# EAGLE design untitled (EAGLE 9.5.1)
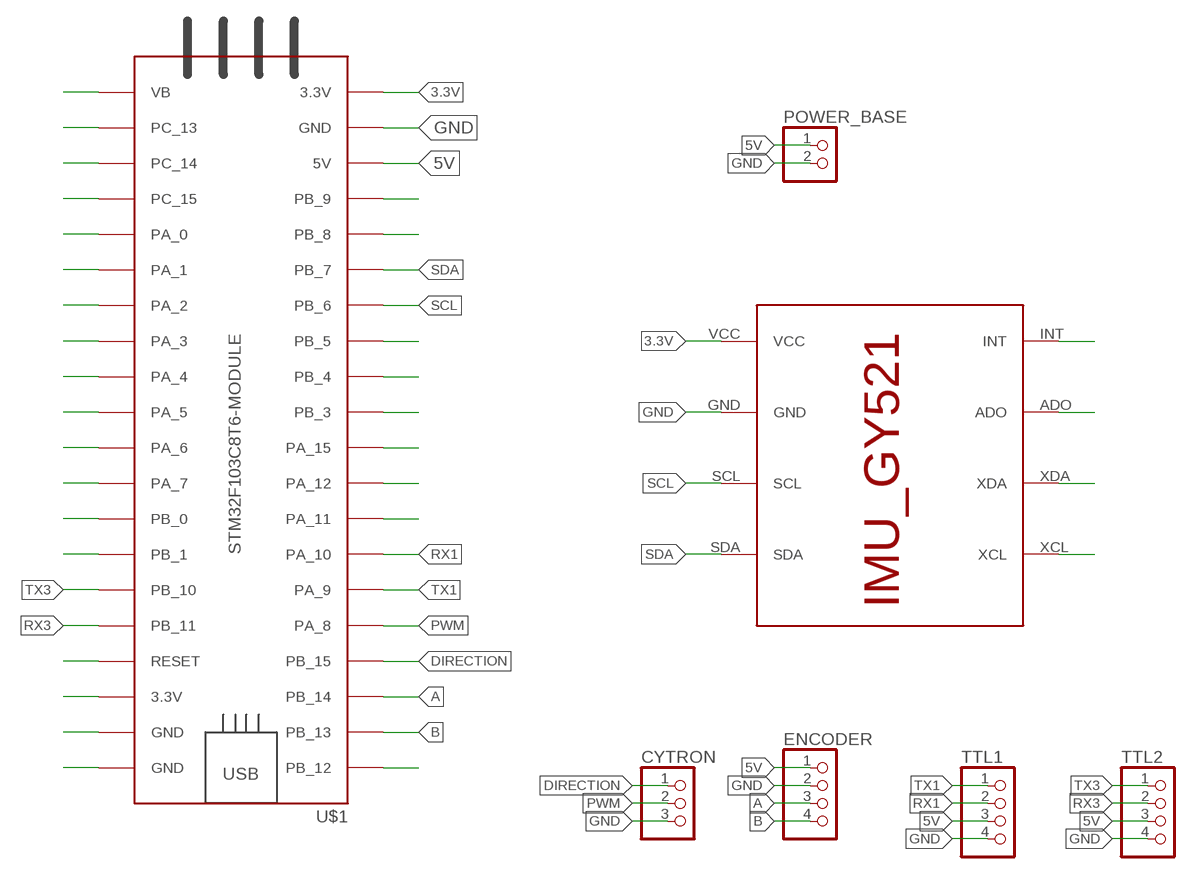
[diagram p0: schematic, sheet 1]

## Parts
CYTRON  PINHD-1X3  [1X03]
ENCODER  PINHD-1X4  [1X04]
POWER_BASE  PINHD-2_DATA  [1X02_DATA]
TTL1  PINHD-1X4  [1X04]
TTL2  PINHD-1X4  [1X04]
U$1  STM32F103C8T6-MODULE  [STM32F103C8T6-MODULE]
U$2  IMU_ROBOCON_GY521  [IMU_GY521]

## Nets
3.3V: U$1.3.3V_1(3.3V) U$1.3.3V_2(3.3V) U$2.VCC
5V: ENCODER.1 POWER_BASE.1 TTL1.3 TTL2.3 U$1.5V
A: ENCODER.3 U$1.PB_14
B: ENCODER.4 U$1.PB_13
DIRECTION: CYTRON.1 U$1.PB_15
GND: CYTRON.3 ENCODER.2 POWER_BASE.2 TTL1.4 TTL2.4 U$1.GND_1(GND) U$1.GND_2(GND) U$1.GND_3(GND) U$2.GND
N$1: U$1.PB_12
N$8: U$1.PA_11
N$9: U$1.PA_12
N$10: U$1.PA_15
N$11: U$1.PB_3
N$12: U$1.PB_4
N$13: U$1.PB_5
N$16: U$1.PB_8
N$17: U$1.PB_9
N$21: U$1.VB
N$22: U$1.PC_13
N$23: U$1.PC_14
N$24: U$1.PC_15
N$25: U$1.PA_0
N$26: U$1.PA_1
N$27: U$1.PA_2
N$28: U$1.PA_3
N$29: U$1.PA_4
N$30: U$1.PA_5
N$31: U$1.PA_6
N$32: U$1.PA_7
N$37: U$1.RESET
N$41: U$2.XCL
N$42: U$2.XDA
N$43: U$2.ADO
N$44: U$2.INT
PWM: CYTRON.2 U$1.PA_8
QWRGF3A: U$1.PB_1
RX1: TTL1.2 U$1.PA_10
RX3: TTL2.2 U$1.PB_11
SCL: U$1.PB_6 U$2.SCL
SDA: U$1.PB_7 U$2.SDA
TX1: TTL1.1 U$1.PA_9
TX3: TTL2.1 U$1.PB_10
WAF: U$1.PB_0

## Library data of the parts
CYTRON = MIA_LIBRARY-2-2-2:PINHD-1X3: PIN HEADER
ENCODER TTL1 TTL2 = MIA_LIBRARY-2-2-2:PINHD-1X4: PIN HEADER
POWER_BASE = MIA_LIBRARY-2-2-2:PINHD-2_DATA: PIN HEADER
U$1 = MIA_LIBRARY-2-2-2:STM32F103C8T6-MODULE: STM32F103C8T6 module with ARM Cortex-3, 20kB SRAM, 64kB Flash, 72MHz
U$2 = MIA_LIBRARY-2-2-2:IMU_ROBOCON_GY521

## Board
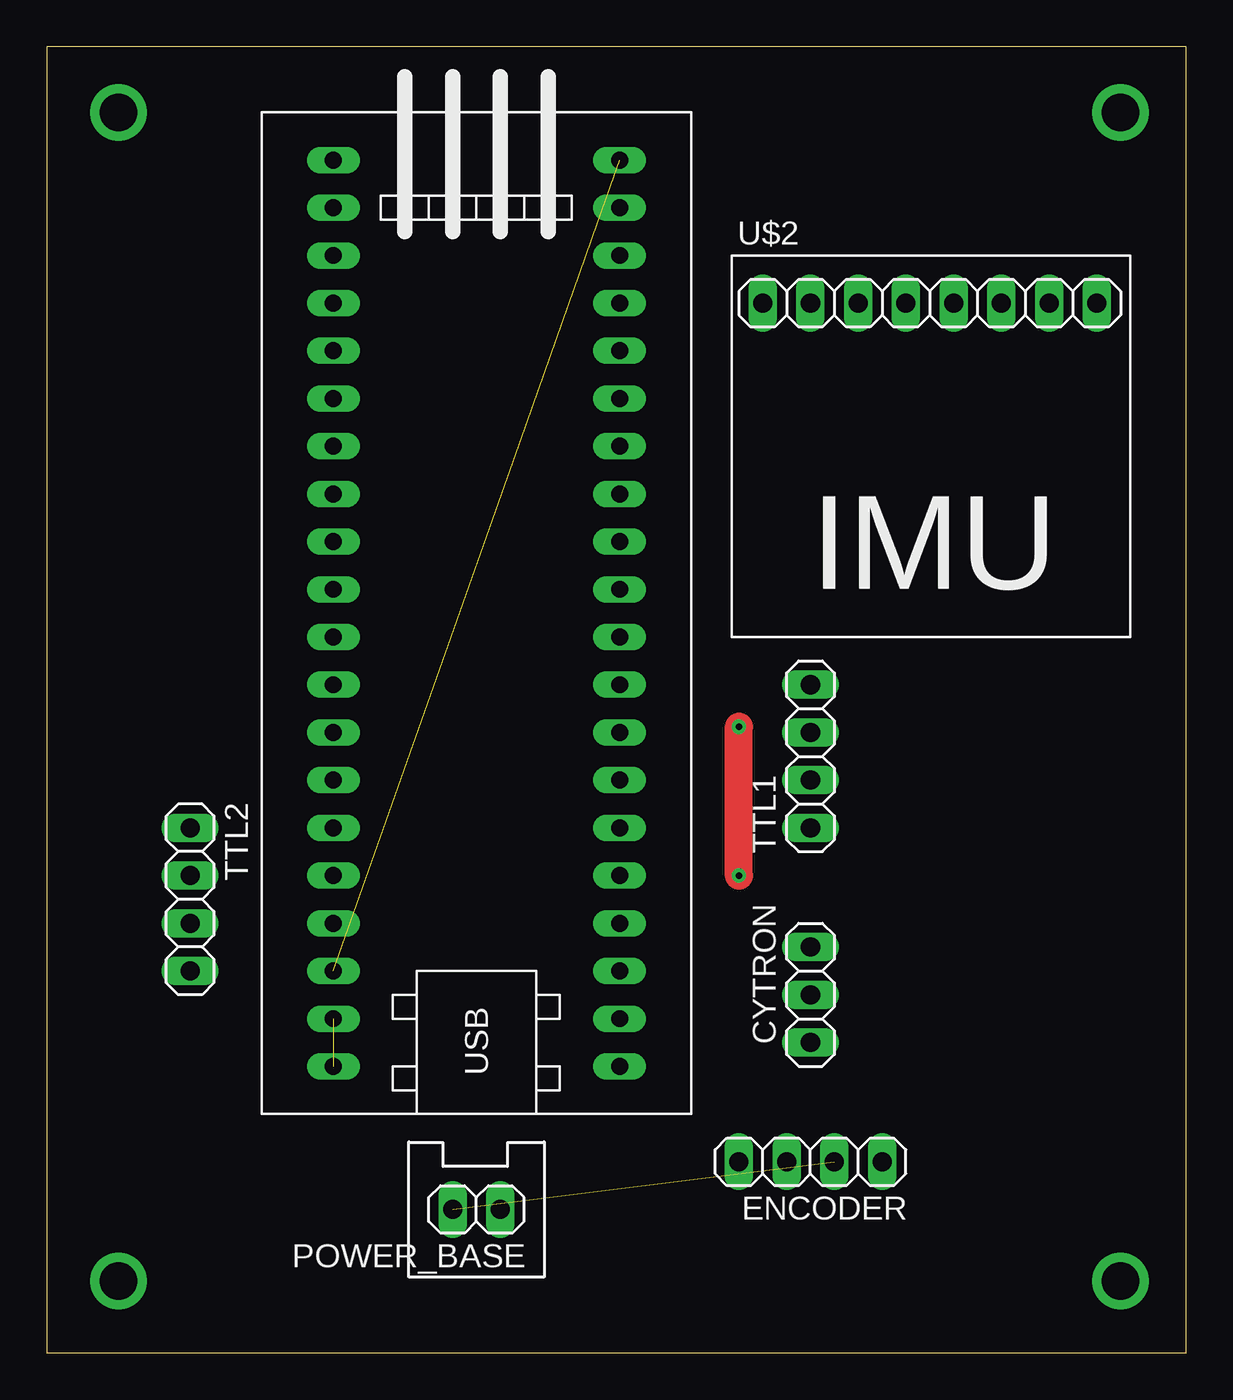
[diagram p1: board, top side]
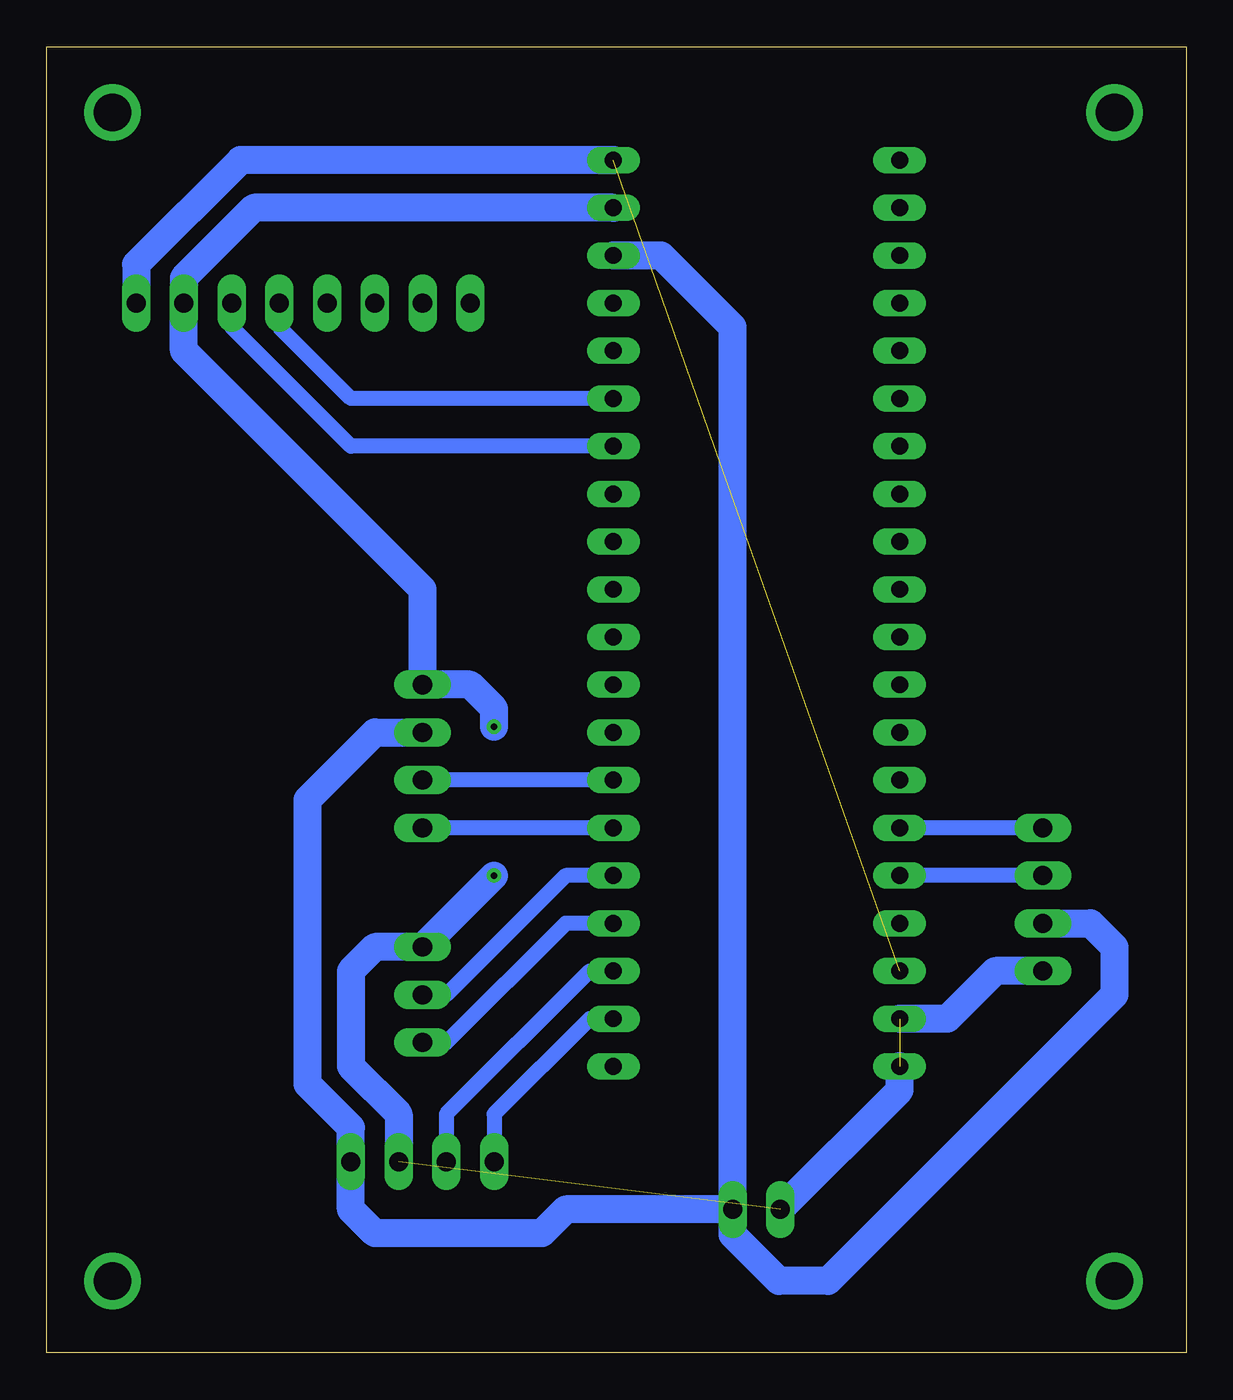
[diagram p2: board, bottom side, seen from below]

Size 60.63 x 69.52 mm. Coordinates in mm from the lower left corner, seen from the top.
Outline: 0,0 60.63,0 60.63,69.52 0,69.52 0,0
Copper layers (1*16): Top 0.035mm / dielectric 1.5mm / Bottom 0.035mm
Design rules "default *": minimum track width 0.8mm, minimum drill 0.35mm, track to track 0.8mm, track to pad 0.7mm, pad to pad 0.8mm, via to via 0.8mm, smd to smd 6mil, copper to edge 1mm, drill to drill 6mil, minimum pad ring 10mil, minimum via ring 8mil, stop-mask expansion 4mil, vias tented up to drill 0mil, thermal gap 10mil

### Footprints (pad centres in the part's own frame; a part is rotated, then mirrored left to right if it is on the bottom)
1X03 = drill 1.016 long: 1 -2.54,0; 2 0,0; 3 2.54,0
1X04 = drill 1.016 long: 1 -3.81,0; 2 -1.27,0; 3 1.27,0; 4 3.81,0
1X02_DATA = drill 1.016 long: 1 -1.27,0; 2 1.27,0
STM32F103C8T6-MODULE = drill 0.9 long: 3.3V_1 25.4,-7.62; 3.3V_2 -17.78,7.62; 5V 20.32,-7.62; GND_1 22.86,-7.62; GND_2 -20.32,7.62; GND_3 -22.86,7.62; PA_0 15.24,7.62; PA_1 12.7,7.62; PA_2 10.16,7.62; PA_3 7.62,7.62; PA_4 5.08,7.62; PA_5 2.54,7.62; PA_6 0,7.62; PA_7 -2.54,7.62; PA_8 -12.7,-7.62; PA_9 -10.16,-7.62; PA_10 -7.62,-7.62; PA_11 -5.08,-7.62; PA_12 -2.54,-7.62; PA_15 0,-7.62; PB_0 -5.08,7.62; PB_1 -7.62,7.62; PB_3 2.54,-7.62; PB_4 5.08,-7.62; PB_5 7.62,-7.62; PB_6 10.16,-7.62; PB_7 12.7,-7.62; PB_8 15.24,-7.62; PB_9 17.78,-7.62; PB_10 -10.16,7.62; PB_11 -12.7,7.62; PB_12 -22.86,-7.62; PB_13 -20.32,-7.62; PB_14 -17.78,-7.62; PB_15 -15.24,-7.62; PC_13 22.86,7.62; PC_14 20.32,7.62; PC_15 17.78,7.62; RESET -15.24,7.62; VB 25.4,7.62
IMU_GY521 = drill 1.016 long: ADO -6.35,0; GND 6.35,0; INT -8.89,0; SCL 3.81,0; SDA 1.27,0; VCC 8.89,0; XCL -3.81,0; XDA -1.27,0

### Placement (x,y rotation side)
CYTRON  40.64,19.05 90 top
ENCODER  40.64,10.16 180 top
POWER_BASE  22.86,7.62 180 top
TTL1  40.64,31.75 90 top
TTL2  7.62,24.13 270 top
U$1  22.86,38.1 90 top
U$2  46.99,55.88 0 top

### Tracks (layer width: path | path; a pad name or v marks a point on that pad's centre or on a via)
3.3V  (1 unrouted)
  Bottom 1.5: U$1.3.3V_1 50.32,63.5 55.88,57.94 U$2.VCC
5V
  Bottom 1.5: TTL2.3 5.08,22.86 3.81,21.59 3.81,19.05 19.05,3.81 21.67,3.81 24.13,6.27 POWER_BASE.1 | TTL1.3 43.18,33.02 46.75,29.45 46.75,14.29 44.45,11.99 ENCODER.1 44.45,7.62 43.18,6.35 34.29,6.35 33.02,7.62 POWER_BASE.1 | POWER_BASE.1 24.13,54.61 27.94,58.42 U$1.5V
A
  Bottom 0.8: U$1.PB_14 31.75,20.32 39.37,12.7 ENCODER.3
B
  Bottom 0.8: U$1.PB_13 31.75,17.78 36.83,12.7 ENCODER.4
DIRECTION
  Bottom 0.8: U$1.PB_15 33.02,22.86 39.37,16.51 CYTRON.1
GND  (via drill 0.35)  (2 unrouted)
  Top 1.5: v36.83,25.4 v36.83,33.33
  Bottom 1.5: U$1.GND_1 49.61,60.96 53.34,57.23 U$2.GND 53.34,53.34 40.64,40.64 TTL1.4 38.1,35.56 36.83,34.29 v36.83,33.33 | POWER_BASE.2 15.24,13.97 U$1.GND_3 | ENCODER.2 41.91,12.7 44.45,15.24 44.45,20.32 43.18,21.59 CYTRON.3 v36.83,25.4 | TTL2.4 10.16,20.32 12.7,17.78 U$1.GND_2
N$2  (via drill 2)
  other vias: 57.15,66.04
N$3  (via drill 2)
  other vias: 3.81,66.04
N$4  (via drill 2)
  other vias: 3.81,3.81
N$5  (via drill 2)
  other vias: 57.15,3.81
PWM
  Bottom 0.8: U$1.PA_8 33.02,25.4 39.37,19.05 CYTRON.2
RX1
  Bottom 0.8: U$1.PA_10 TTL1.2
RX3
  Bottom 0.8: TTL2.2 U$1.PB_11
SCL
  Bottom 0.8: U$1.PB_6 44.45,48.26 50.8,54.61 U$2.SCL
SDA
  Bottom 0.8: U$1.PB_7 44.45,50.8 48.26,54.61 U$2.SDA
TX1
  Bottom 0.8: U$1.PA_9 TTL1.1
TX3
  Bottom 0.8: TTL2.1 U$1.PB_10